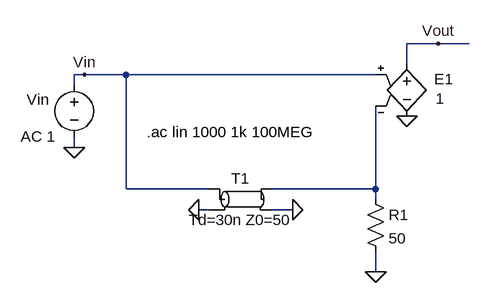
[diagram p0: schematic _Fig1_25_K_is_3_AC_MSD.asc]
_Fig1_25_K_is_3_AC_MSD.asc, the LTspice schematic file:
Version 4
SHEET 1 1056 688
WIRE 752 256 704 256
WIRE 800 256 752 256
WIRE 704 288 704 256
WIRE 208 304 192 304
WIRE 272 304 208 304
WIRE 656 304 272 304
WIRE 192 320 192 304
WIRE 192 416 192 400
WIRE 272 480 272 304
WIRE 400 480 272 480
WIRE 656 480 656 352
WIRE 656 480 496 480
WIRE 656 496 656 480
WIRE 400 512 384 512
WIRE 528 512 496 512
WIRE 656 608 656 576
FLAG 656 608 0
FLAG 528 512 0
FLAG 384 512 0
FLAG 192 416 0
FLAG 208 304 Vin
FLAG 752 256 Vout
FLAG 704 368 0
SYMBOL tline 448 496 R0
SYMATTR InstName T1
SYMATTR Value Td=30n Z0=50
SYMBOL res 640 480 R0
SYMATTR InstName R1
SYMATTR Value 50
SYMBOL voltage 192 304 R0
WINDOW 0 -73 38 Left 0
WINDOW 123 -82 95 Left 0
WINDOW 39 0 0 Left 0
SYMATTR InstName Vin
SYMATTR Value2 AC 1
SYMATTR Value ""
SYMBOL e 704 272 R0
WINDOW 0 42 39 Left 0
WINDOW 3 44 69 Left 0
SYMATTR InstName E1
SYMATTR Value 1
TEXT 304 392 Left 0 !.ac lin 1000 1k 100MEG

The netlist it stands for:
* _Fig1_25_K_is_3_AC_MSD.asc
T1 Vin 0 N001 0 Td=30n Z0=50
R1 N001 0 50
Vin Vin 0 AC 1
E1 Vout 0 Vin N001 1
.ac lin 1000 1k 100MEG
.backanno
.end